# EAGLE design tally-controller-shield (EAGLE 9.4.2)
Arduino Mega Shield for Tally Controller Includes 12 channels of RS485 output, 1 NeoPixel output, 4pin I2C output, XBee serial I/O using XBee regulated breakout, 2 potentiometers for dimming the tally lights, and 1 toggle switch for talent preview.
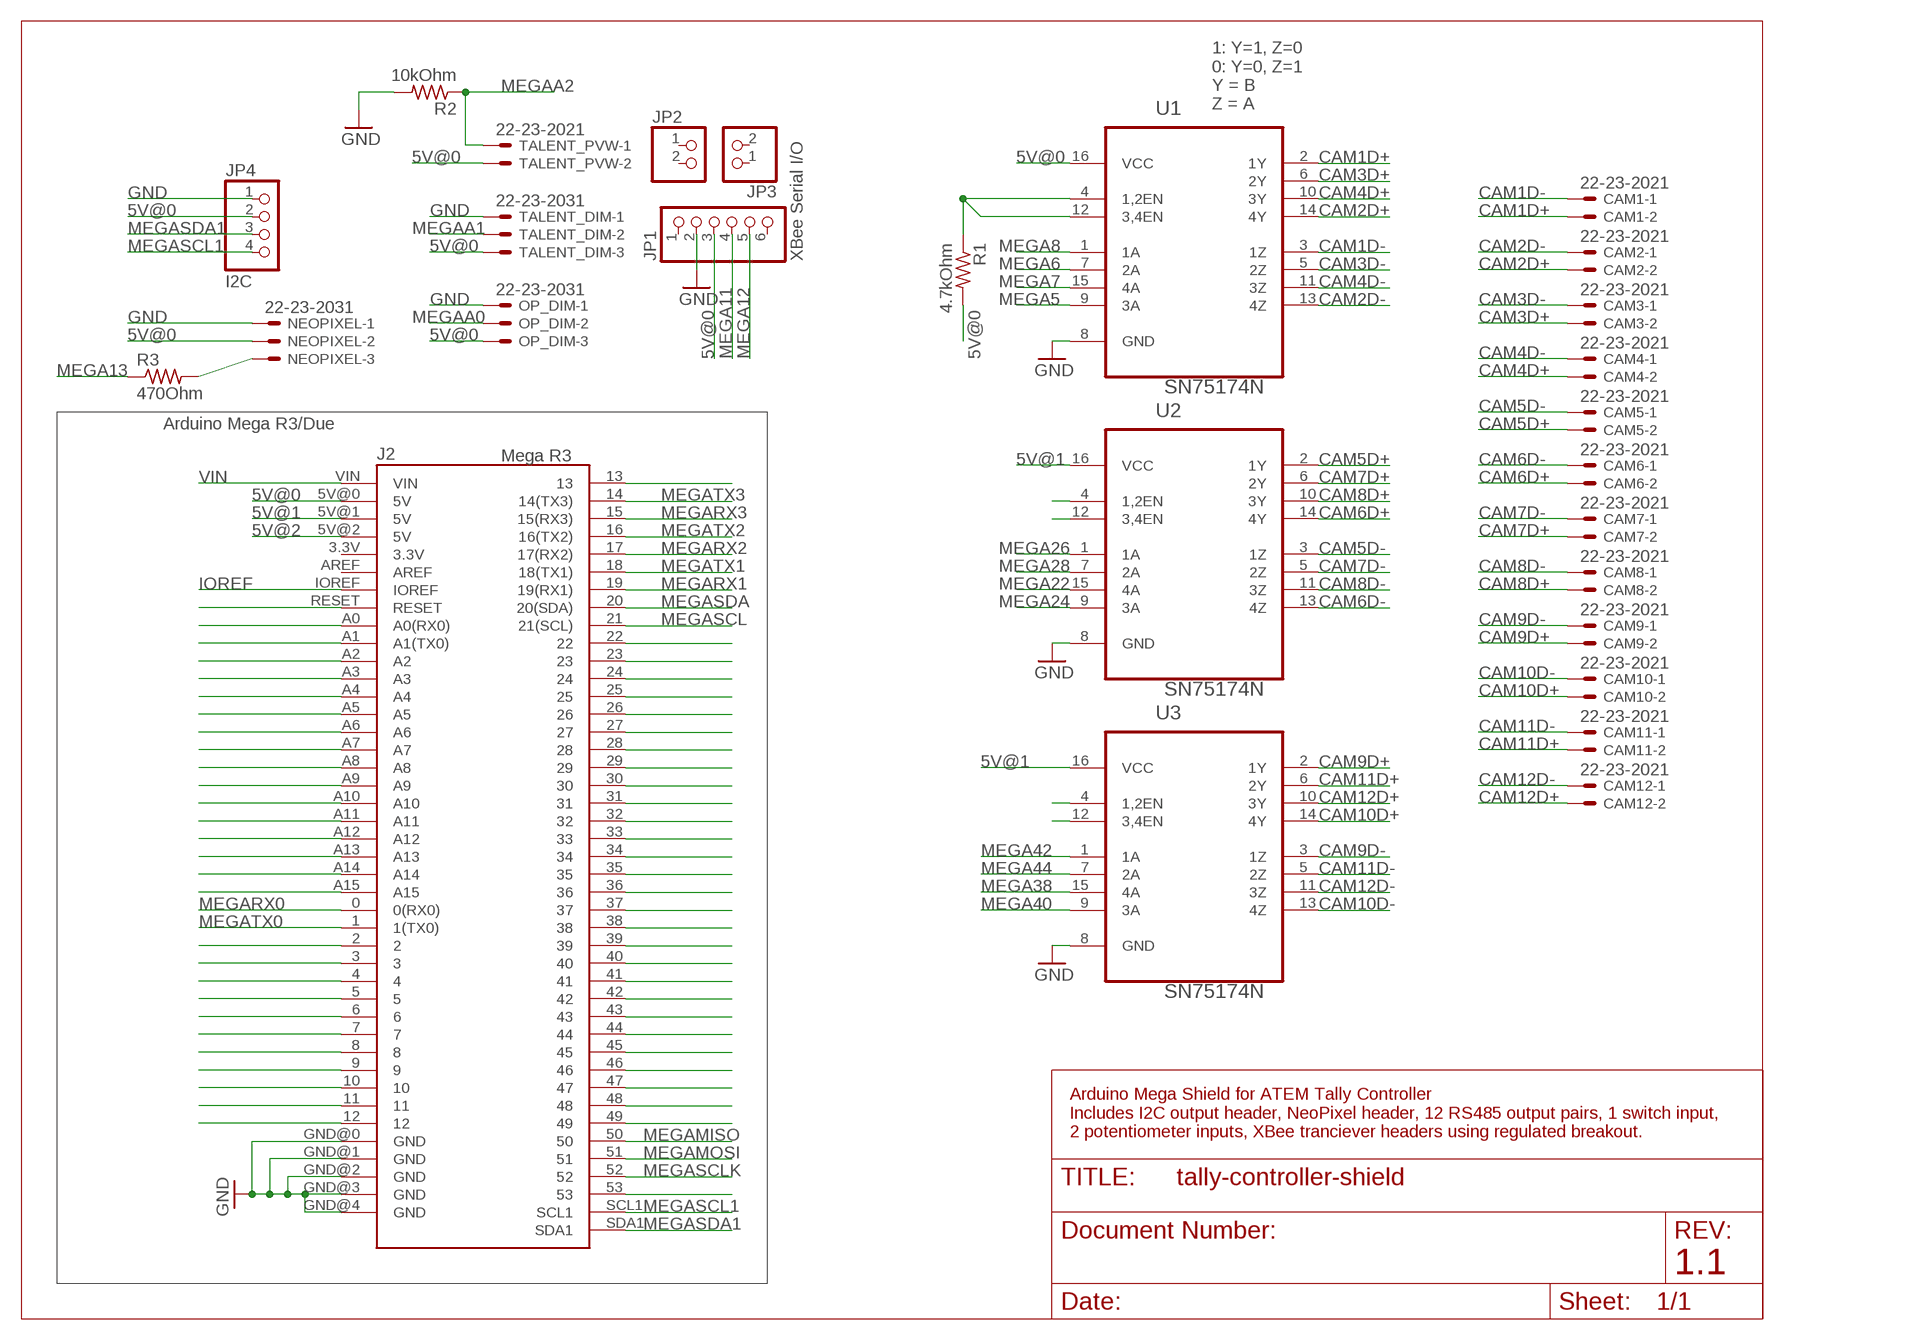
[diagram p0: schematic, sheet 1]

## Parts
CAM1  22-23-2021  [22-23-2021]
CAM2  22-23-2021  [22-23-2021]
CAM3  22-23-2021  [22-23-2021]
CAM4  22-23-2021  [22-23-2021]
CAM5  22-23-2021  [22-23-2021]
CAM6  22-23-2021  [22-23-2021]
CAM7  22-23-2021  [22-23-2021]
CAM8  22-23-2021  [22-23-2021]
CAM9  22-23-2021  [22-23-2021]
CAM10  22-23-2021  [22-23-2021]
CAM11  22-23-2021  [22-23-2021]
CAM12  22-23-2021  [22-23-2021]
J2  Mega R3  ARDUINO-MEGAFULL  [ARDUINO_MEGA]
JP1  XBee Serial I/O  PINHD-1X6  [1X06]
JP2  PINHD-1X2  [1X02]
JP3  PINHD-1X2  [1X02]
JP4  I2C  PINHD-1X4  [1X04]
NEOPIXEL  22-23-2031  [22-23-2031]
OP_DIM  22-23-2031  [22-23-2031]
R1  4.7kOhm  R-US_0207/10  [0207/10]
R2  10kOhm  R-US_0207/10  [0207/10]
R3  470Ohm  R-US_0207/10  [0207/10]
TALENT_DIM  22-23-2031  [22-23-2031]
TALENT_PVW  22-23-2021  [22-23-2021]
U1  SN75174N  [DIP254P762X508-16]
U2  SN75174N  [DIP254P762X508-16]
U3  SN75174N  [DIP254P762X508-16]

## Nets
5V@0: J2.5V@0(5V) JP1.3 JP4.2 NEOPIXEL.2 OP_DIM.3 R1.2 TALENT_DIM.3 TALENT_PVW.2 U1.16(VCC)
5V@1: J2.5V@1(5V) U2.16(VCC) U3.16(VCC)
5V@2: J2.5V@2(5V)
CAM1D+: CAM1.2 U1.2(1Y)
CAM1D-: CAM1.1 U1.3(1Z)
CAM2D+: CAM2.2 U1.14(4Y)
CAM2D-: CAM2.1 U1.13(4Z)
CAM3D+: CAM3.2 U1.6(2Y)
CAM3D-: CAM3.1 U1.5(2Z)
CAM4D+: CAM4.2 U1.10(3Y)
CAM4D-: CAM4.1 U1.11(3Z)
CAM5D+: CAM5.2 U2.2(1Y)
CAM5D-: CAM5.1 U2.3(1Z)
CAM6D+: CAM6.2 U2.14(4Y)
CAM6D-: CAM6.1 U2.13(4Z)
CAM7D+: CAM7.2 U2.6(2Y)
CAM7D-: CAM7.1 U2.5(2Z)
CAM8D+: CAM8.2 U2.10(3Y)
CAM8D-: CAM8.1 U2.11(3Z)
CAM9D+: CAM9.2 U3.2(1Y)
CAM9D-: CAM9.1 U3.3(1Z)
CAM10D+: CAM10.2 U3.14(4Y)
CAM10D-: CAM10.1 U3.13(4Z)
CAM11D+: CAM11.2 U3.6(2Y)
CAM11D-: CAM11.1 U3.5(2Z)
CAM12D+: CAM12.2 U3.10(3Y)
CAM12D-: CAM12.1 U3.11(3Z)
GND: J2.GND@0(GND) J2.GND@1(GND) J2.GND@2(GND) J2.GND@3(GND) J2.GND@4(GND) JP1.2 JP4.1 NEOPIXEL.1 OP_DIM.1 R2.2 TALENT_DIM.1 U1.8(GND) U2.8(GND) U3.8(GND)
IOREF: J2.IOREF
MEGA2: J2.2
MEGA3: J2.3
MEGA4: J2.4
MEGA5: J2.5 U1.9(3A)
MEGA6: J2.6 U1.7(2A)
MEGA7: J2.7 U1.15(4A)
MEGA8: J2.8 U1.1(1A)
MEGA9: J2.9
MEGA10: J2.10
MEGA11: J2.11 JP1.4
MEGA12: J2.12 JP1.5
MEGA13: J2.13 R3.1
MEGA22: J2.22 U2.15(4A)
MEGA23: J2.23
MEGA24: J2.24 U2.9(3A)
MEGA25: J2.25
MEGA26: J2.26 U2.1(1A)
MEGA27: J2.27
MEGA28: J2.28 U2.7(2A)
MEGA29: J2.29
MEGA30: J2.30
MEGA31: J2.31
MEGA32: J2.32
MEGA33: J2.33
MEGA34: J2.34
MEGA35: J2.35
MEGA36: J2.36
MEGA37: J2.37
MEGA38: J2.38 U3.15(4A)
MEGA39: J2.39
MEGA40: J2.40 U3.9(3A)
MEGA41: J2.41
MEGA42: J2.42 U3.1(1A)
MEGA43: J2.43
MEGA44: J2.44 U3.7(2A)
MEGA45: J2.45
MEGA46: J2.46
MEGA47: J2.47
MEGA48: J2.48
MEGA49: J2.49
MEGA53: J2.53
MEGAA0: J2.A0(A0(RX0)) OP_DIM.2
MEGAA1: J2.A1(A1(TX0)) TALENT_DIM.2
MEGAA2: J2.A2 R2.1 TALENT_PVW.1
MEGAA3: J2.A3
MEGAA4: J2.A4
MEGAA5: J2.A5
MEGAA6: J2.A6
MEGAA7: J2.A7
MEGAA8: J2.A8
MEGAA9: J2.A9
MEGAA10: J2.A10
MEGAA11: J2.A11
MEGAA12: J2.A12
MEGAA13: J2.A13
MEGAA14: J2.A14
MEGAA15: J2.A15
MEGAMISO: J2.50
MEGAMOSI: J2.51
MEGARX0: J2.0(0(RX0))
MEGARX1: J2.19(19(RX1))
MEGARX2: J2.17(17(RX2))
MEGARX3: J2.15(15(RX3))
MEGASCL: J2.21(21(SCL))
MEGASCL1: J2.SCL1 JP4.4
MEGASCLK: J2.52
MEGASDA: J2.20(20(SDA))
MEGASDA1: J2.SDA1 JP4.3
MEGATX0: J2.1(1(TX0))
MEGATX1: J2.18(18(TX1))
MEGATX2: J2.16(16(TX2))
MEGATX3: J2.14(14(TX3))
NEOPIXELDATA: NEOPIXEL.3 R3.2
RESET: J2.RESET
RS485EN: R1.1 U1.4(1,2EN) U1.12(3,4EN) U2.4(1,2EN) U2.12(3,4EN) U3.4(1,2EN) U3.12(3,4EN)
VIN [pwr]: J2.VIN
Unconnected: J2.3.3V J2.AREF JP1.1 JP1.6 JP2.1 JP2.2 JP3.1 JP3.2

## Notes on the sheet
- 1: Y=1, Z=0
  0: Y=0, Z=1
  Y = B
  Z = A
- Arduino Mega R3/Due
- Arduino Mega Shield for ATEM Tally Controller
  Includes I2C output header, NeoPixel header, 12 RS485 output pairs, 1 switch input, 
  2 potentiometer inputs, XBee tranciever headers using regulated breakout.
- 1.1

## Library data of the parts
CAM1-CAM12 TALENT_PVW = con-molex:22-23-2021: .100" (2.54mm) Center Header - 2 Pin; MF: MOLEX; MPN: 22-23-2021; OC_FARNELL: 1462926; OC_NEWARK: 25C3832
J2 = zortness:ARDUINO-MEGA: Arduino MegaR3 board footprint. Also works for Due.
JP1 = pinhead:PINHD-1X6: PIN HEADER
JP2 JP3 = pinhead:PINHD-1X2: PIN HEADER
JP4 = pinhead:PINHD-1X4: PIN HEADER
NEOPIXEL OP_DIM TALENT_DIM = con-molex:22-23-2031: .100" (2.54mm) Center Header - 3 Pin; MF: MOLEX; MPN: 22-23-2031; OC_FARNELL: 1462950; OC_NEWARK: 30C0862
R1-R3 = rcl:R-US_: RESISTOR, American symbol; SPICEPREFIX: R
U1-U3 = SN75174N:SN75174N: QUADRUPLE DIFFERENTIAL LINE DRIVER; AVAILABILITY: Unavailable; DESCRIPTION: SN75174N - Texas Instruments IC Quad Transmitter RS-422/RS-485 16-Pin PDIP; MF: Texas Instruments; MP: SN75174N; PACKAGE: PDIP-16 Texas Instruments; PRICE: None

## Net classes
1 pwr: width 0.305 mm
2 raw: width 0.305 mm

## Board
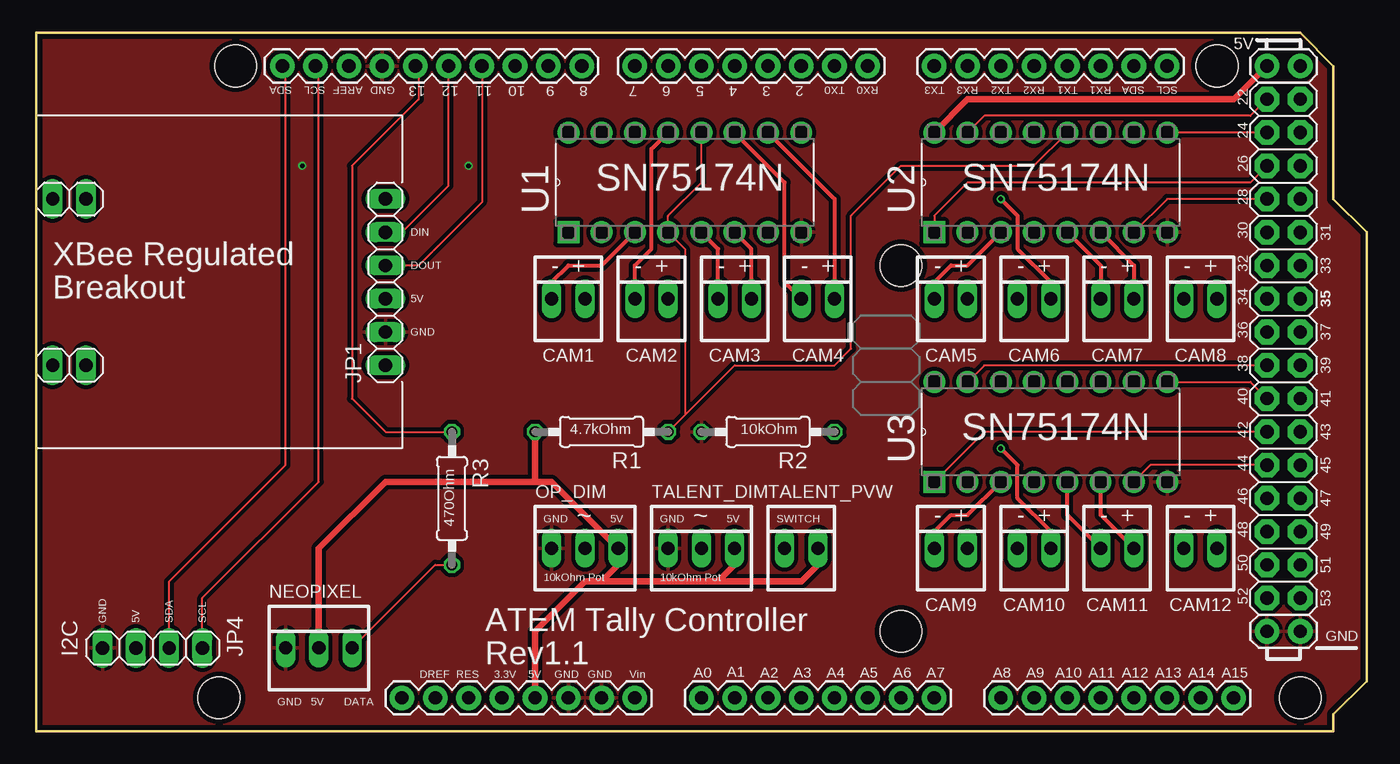
[diagram p1: board, top side]
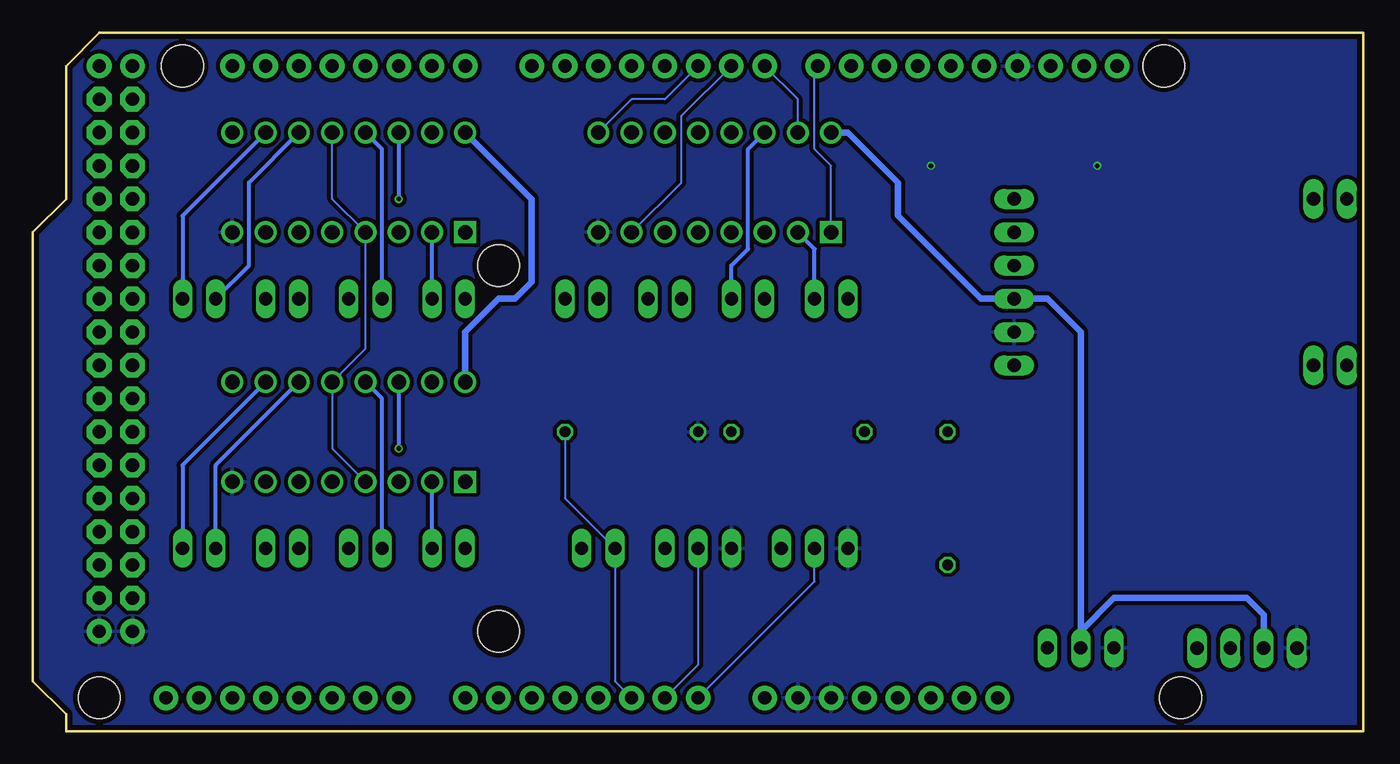
[diagram p2: board, bottom side, seen from below]

Size 101.6 x 53.34 mm. Coordinates in mm from the lower left corner, seen from the top.
Copper layers (1*16): Top 0.035559375mm / dielectric 1.6mm / Bottom 0.035559375mm
Design rules "oshpark-2layer": minimum track width 6mil, minimum drill 10mil, track to track 6mil, track to pad 6mil, pad to pad 6mil, via to via 6mil, smd to smd 6mil, copper to edge 15mil, drill to drill 6mil, minimum pad ring 5mil, minimum via ring 5mil, stop-mask expansion 2.5mil, vias tented up to drill 0mil, thermal gap 10mil

### Footprints (pad centres in the part's own frame; a part is rotated, then mirrored left to right if it is on the bottom)
22-23-2021 = drill 1 long: 1 -1.27,0; 2 1.27,0
ARDUINO_MEGA = drill 1.016 pad 1.88: 0 63.5,50.8; 1 60.96,50.8; 2 58.42,50.8; 3 55.88,50.8; 3.3V 35.56,2.54; 4 53.34,50.8; 5 50.8,50.8; 5V@0 38.1,2.54; 5V@1 93.98,50.8; 5V@2 96.52,50.8; 6 48.26,50.8; 7 45.72,50.8; 8 41.656,50.8; 9 39.116,50.8; 10 36.576,50.8; 11 34.036,50.8; 12 31.496,50.8; 13 28.956,50.8; 14 68.58,50.8; 15 71.12,50.8; 16 73.66,50.8; 17 76.2,50.8; 18 78.74,50.8; 19 81.28,50.8; 20 83.82,50.8; 21 86.36,50.8; A0 50.8,2.54; A1 53.34,2.54; A2 55.88,2.54; A3 58.42,2.54; A4 60.96,2.54; A5 63.5,2.54; A6 66.04,2.54; A7 68.58,2.54; A8 73.66,2.54; A9 76.2,2.54; A10 78.74,2.54; A11 81.28,2.54; A12 83.82,2.54; A13 86.36,2.54; A14 88.9,2.54; A15 91.44,2.54; AREF 23.876,50.8; EMPTY 27.94,2.54; GND@0 40.64,2.54; GND@1 43.18,2.54; GND@2 93.98,7.62; GND@3 96.52,7.62; GND@4 26.416,50.8; IOREF 30.48,2.54; RESET 33.02,2.54; SCL1 21.336,50.8; SDA1 18.796,50.8; VIN 45.72,2.54 | drill 1.016 pad 1.88 octagon: 22 93.98,48.26; 23 96.52,48.26; 24 93.98,45.72; 25 96.52,45.72; 26 93.98,43.18; 27 96.52,43.18; 28 93.98,40.64; 29 96.52,40.64; 30 93.98,38.1; 31 96.52,38.1; 32 93.98,35.56; 33 96.52,35.56; 34 93.98,33.02; 35 96.52,33.02; 36 93.98,30.48; 37 96.52,30.48; 38 93.98,27.94; 39 96.52,27.94; 40 93.98,25.4; 41 96.52,25.4; 42 93.98,22.86; 43 96.52,22.86; 44 93.98,20.32; 45 96.52,20.32; 46 93.98,17.78; 47 96.52,17.78; 48 93.98,15.24; 49 96.52,15.24; 50 93.98,12.7; 51 96.52,12.7; 52 93.98,10.16; 53 96.52,10.16 | hole 3.2: 15.24,50.8; 13.97,2.54; 66.04,35.56; 66.04,7.62; 90.17,50.8; 96.52,2.54
1X06 = drill 1.016 long: 1 -6.35,0; 2 -3.81,0; 3 -1.27,0; 4 1.27,0; 5 3.81,0; 6 6.35,0
1X02 = drill 1.016 long: 1 -1.27,0; 2 1.27,0
1X04 = drill 1.016 long: 1 -3.81,0; 2 -1.27,0; 3 1.27,0; 4 3.81,0
22-23-2031 = drill 1 long: 1 -2.54,0; 2 0,0; 3 2.54,0
0207/10 = drill 0.813 octagon: 1 -5.08,0; 2 5.08,0
DIP254P762X508-16 = drill 1.118 square: 1 -7.62,17.78 | drill 1.118: 2 -7.62,15.24; 3 -7.62,12.7; 4 -7.62,10.16; 5 -7.62,7.62; 6 -7.62,5.08; 7 -7.62,2.54; 8 -7.62,0; 9 0,0; 10 0,2.54; 11 0,5.08; 12 0,7.62; 13 0,10.16; 14 0,12.7; 15 0,15.24; 16 0,17.78

### Placement (x,y rotation side)
CAM1  40.64,33.02 0 top
CAM2  46.99,33.02 0 top
CAM3  53.34,33.02 0 top
CAM4  59.69,33.02 0 top
CAM5  69.85,33.02 0 top
CAM6  76.2,33.02 0 top
CAM7  82.55,33.02 0 top
CAM8  88.9,33.02 0 top
CAM9  69.85,13.97 0 top
CAM10  76.2,13.97 0 top
CAM11  82.55,13.97 0 top
CAM12  88.9,13.97 0 top
J2  0,0 0 top
JP1  26.67,34.29 90 top
JP2  2.54,40.64 0 top
JP3  2.54,27.94 0 top
JP4  8.89,6.35 0 top
NEOPIXEL  21.59,6.35 0 top
OP_DIM  41.91,13.97 0 top
R1  43.18,22.86 180 top
R2  55.88,22.86 180 top
R3  31.75,17.78 270 top
TALENT_DIM  50.8,13.97 0 top
TALENT_PVW  58.42,13.97 0 top
U1  58.42,45.72 90 top
U2  86.36,45.72 90 top
U3  86.36,26.67 90 top

### Tracks (layer width: path | path; a pad name or v marks a point on that pad's centre or on a via)
5V@0
  Top 0.508: TALENT_PVW.2 59.69,12.7 58.42,11.43 52.07,11.43 | 52.07,11.43 43.18,11.43 | 43.18,11.43 41.91,11.43 38.1,7.62 J2.5V@0 | 38.1,19.05 39.37,19.05 OP_DIM.3 44.45,12.7 43.18,11.43 | TALENT_DIM.3 53.34,12.7 52.07,11.43 | R1.2 38.1,19.05 | 38.1,19.05 26.67,19.05 21.59,13.97 NEOPIXEL.2
  Bottom 0.508: U1.16 39.37,45.72 35.56,41.91 35.56,39.37 29.21,33.02 JP1.3 24.13,33.02 21.59,30.48 21.59,7.62 | NEOPIXEL.2 21.59,7.62 | JP4.2 7.62,8.89 8.89,10.16 19.05,10.16 21.59,7.62
5V@1
  Top 0.508: J2.5V@1 91.44,48.26 71.12,48.26 U2.16
  Bottom 0.508: U2.16 63.5,40.64 63.5,34.29 64.77,33.02 66.04,33.02 68.58,30.48 U3.16
CAM1D+
  Bottom 0.305: CAM1.2 41.91,36.83 U1.2
CAM1D-
  Top 0.305: CAM1.1 39.37,34.29 40.64,35.56 43.18,35.56 U1.3
CAM2D+
  Bottom 0.305: CAM2.2 48.26,35.56 46.99,36.83 46.99,44.45 U1.14
CAM2D-
  Top 0.305: CAM2.1 45.72,35.56 46.99,36.83 46.99,44.45 U1.13
CAM3D+
  Top 0.305: CAM3.2 54.61,36.83 U1.6
CAM3D-
  Top 0.305: CAM3.1 52.07,36.83 U1.5
CAM4D+
  Top 0.305: U1.10 60.96,40.64 CAM4.2
CAM4D-
  Top 0.305: CAM4.1 57.15,34.29 57.15,41.91 U1.11
CAM5D+
  Bottom 0.305: CAM5.2 U2.2
CAM5D-
  Top 0.305: CAM5.1 68.58,34.29 69.85,35.56 71.12,35.56 U2.3
CAM6D+  (via drill 0.35)
  Top 0.305: v73.66,40.64 74.93,39.37 74.93,36.83 77.47,34.29 CAM6.2
  Bottom 0.305: U2.14 v73.66,40.64
CAM6D-
  Bottom 0.305: CAM6.1 74.93,44.45 U2.13
CAM7D+
  Top 0.305: U2.6 83.82,35.56 CAM7.2
CAM7D-
  Top 0.305: U2.5 81.28,35.56 CAM7.1
CAM8D+
  Bottom 0.305: U2.10 90.17,39.37 CAM8.2
CAM8D-
  Bottom 0.305: CAM8.1 85.09,35.56 85.09,41.91 U2.11
CAM9D+
  Bottom 0.305: CAM9.2 U3.2
CAM9D-
  Top 0.305: CAM9.1 68.58,15.24 69.85,16.51 71.12,16.51 U3.3
CAM10D+  (via drill 0.35)
  Top 0.305: CAM10.2 77.47,15.24 74.93,17.78 74.93,20.32 v73.66,21.59
  Bottom 0.305: U3.14 v73.66,21.59
CAM10D-
  Bottom 0.305: CAM10.1 74.93,25.4 U3.13
CAM11D+
  Top 0.305: CAM11.2 81.28,16.51 U3.6
CAM11D-
  Top 0.305: CAM11.1 78.74,16.51 U3.5
CAM12D+
  Bottom 0.305: U3.10 90.17,20.32 CAM12.2
CAM12D-
  Bottom 0.305: CAM12.1 87.63,20.32 U3.11
GND  (via drill 0.35)
  other vias: 33.02,43.18 20.32,43.18
  pour Top (isolate 0.305): 0,53.34 101.6,53.34 101.6,0 0,0
  pour Bottom (isolate 0.305): 0,53.34 101.6,53.34 101.6,3.81 102.87,2.54 102.87,0 0,0
MEGA5
  Bottom 0.152: J2.5 53.34,48.26 55.88,48.26 U1.9
MEGA6
  Bottom 0.152: U1.7 52.07,41.91 52.07,46.99 J2.6
MEGA7
  Bottom 0.152: U1.15 43.18,48.26 J2.7
MEGA8
  Bottom 0.152: U1.1 40.64,43.18 41.91,44.45 41.91,50.55 J2.8
MEGA11
  Top 0.152: J2.11 34.04,40.39 29.21,35.56 JP1.4
MEGA12
  Top 0.152: JP1.5 27.94,38.1 31.5,41.66 J2.12
MEGA13
  Top 0.152: J2.13 29.21,50.55 29.21,48.26 24.13,43.18 24.13,25.4 26.67,22.86 R3.1
MEGA22
  Top 0.152: J2.22 92.71,46.99 72.39,46.99 U2.15
MEGA24
  Top 0.152: J2.24 U2.9
MEGA26
  Top 0.152: J2.26 92.71,41.91 71.12,41.91 68.58,39.37 U2.1
MEGA28
  Top 0.152: J2.28 86.36,40.64 U2.7
MEGA38
  Top 0.152: J2.38 72.39,27.94 U3.15
MEGA40
  Top 0.152: U3.9 92.71,26.67 J2.40
MEGA42
  Top 0.152: J2.42 72.39,22.86 U3.1
MEGA44
  Top 0.152: J2.44 85.09,20.32 U3.7
MEGAA0
  Bottom 0.152: J2.A0 41.91,11.43 OP_DIM.2
MEGAA1
  Bottom 0.152: TALENT_DIM.2 50.8,5.08 J2.A1
MEGAA2
  Bottom 0.152: J2.A2 57.15,3.81 TALENT_PVW.1 60.96,17.78 R2.1
MEGASCL1
  Top 0.152: JP4.4 12.7,10.16 21.59,19.05 21.59,50.55 J2.SCL1
MEGASDA1
  Top 0.152: JP4.3 10.16,11.43 19.05,20.32 19.05,50.55 J2.SDA1
NEOPIXELDATA
  Top 0.152: NEOPIXEL.3 30.48,12.7 R3.2
RS485EN
  Top 0.152: U1.12 50.8,41.91 48.26,39.37 U1.4 49.53,36.83 49.53,24.13 R1.1 53.34,27.94 60.96,27.94 62.23,29.21 62.23,39.37 66.04,43.18 76.2,43.18 U2.12
  Bottom 0.152: U2.12 78.74,40.64 U2.4 76.2,29.21 U3.12 78.74,21.59 U3.4

### Text on the board
tNames: DIN | XBee Regulated | DOUT | - + | - + | - + | - + | - + | - + | - + | - + | Breakout | 5V | GND | GND | ~ | 5V | GND | ~ | 5V | SWITCH | - + | - + | - + | - + | 10kOhm Pot | 10kOhm Pot | GND | 5V | SDA | SCL | ATEM Tally Controller | Rev1.1 | GND | 5V | DATA